# EAGLE design BusBoard (EAGLE 9.6.2)
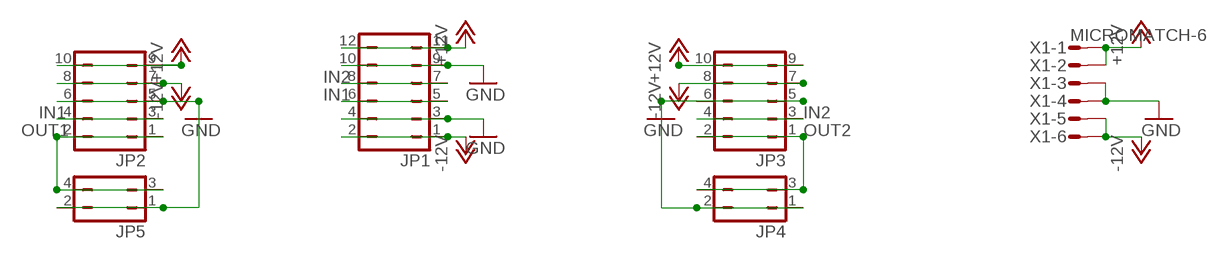
[diagram p0: schematic, sheet 1]

## Parts
JP1  JP6Q  [JP6Q]
JP2  JP5Q  [JP5Q]
JP3  JP5Q  [JP5Q]
JP4  JP2Q  [JP2Q]
JP5  JP2Q  [JP2Q]
X1  MICROMATCH-6  [MICROMATCH-6]

## Nets
+12V: JP1.11 JP1.12 JP2.9 JP2.10 JP3.9 JP3.10 X1.1 X1.2
-12V: JP1.1 JP1.2 JP2.7 JP2.8 JP3.7 JP3.8 X1.5 X1.6
GND: JP1.3 JP1.4 JP1.9 JP1.10 JP2.5 JP2.6 JP3.5 JP3.6 JP4.1 JP4.2 JP5.1 JP5.2 X1.3 X1.4
IN1: JP1.5 JP1.6 JP2.3 JP2.4
IN2: JP1.7 JP1.8 JP3.3 JP3.4
OUT1: JP2.1 JP2.2 JP5.3 JP5.4
OUT2: JP3.1 JP3.2 JP4.3 JP4.4

## Library data of the parts
JP1 = jumper:JP6Q: JUMPER
JP2 JP3 = jumper:JP5Q: JUMPER
JP4 JP5 = jumper:JP2Q: JUMPER
X1 = con-amp-micromatch:MICROMATCH-6: MicroMaTch 6 7-215464-6 / 0-215464-6 Drawing Number C-215464 DDEController.pdf; MPN: 7-215464-6; OC_FARNELL: 3784630; OC_NEWARK: 19R8125

## Board
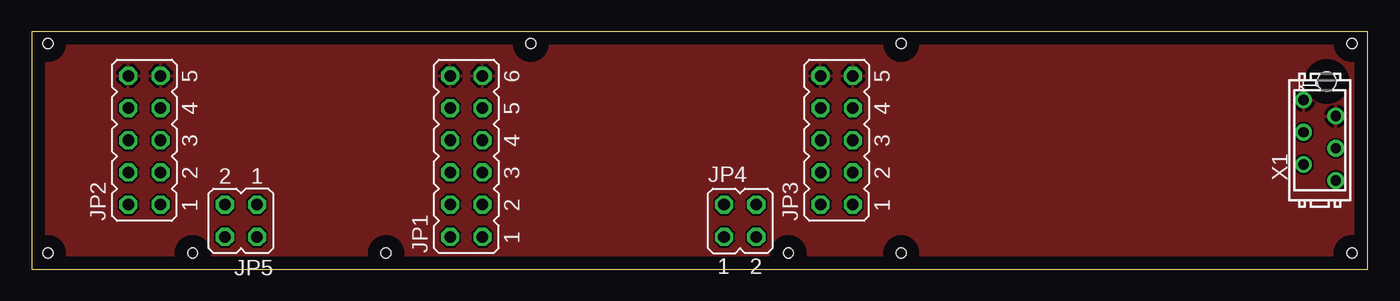
[diagram p1: board, top side]
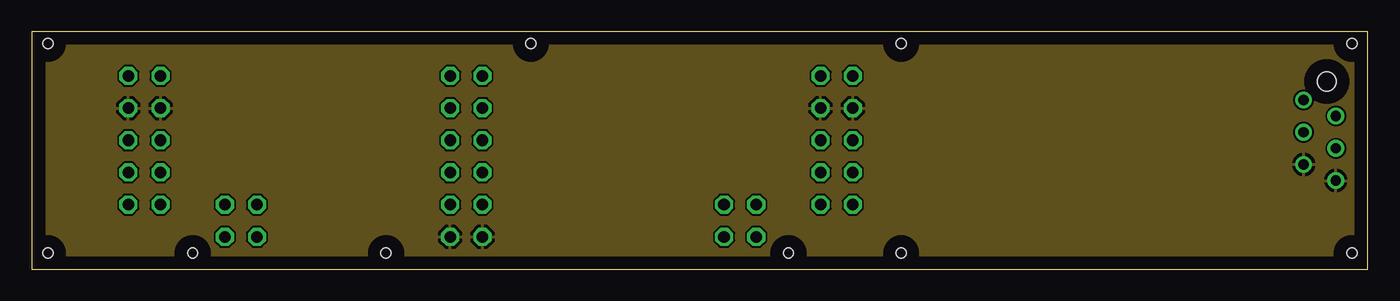
[diagram p2: board, inner layer Route2]
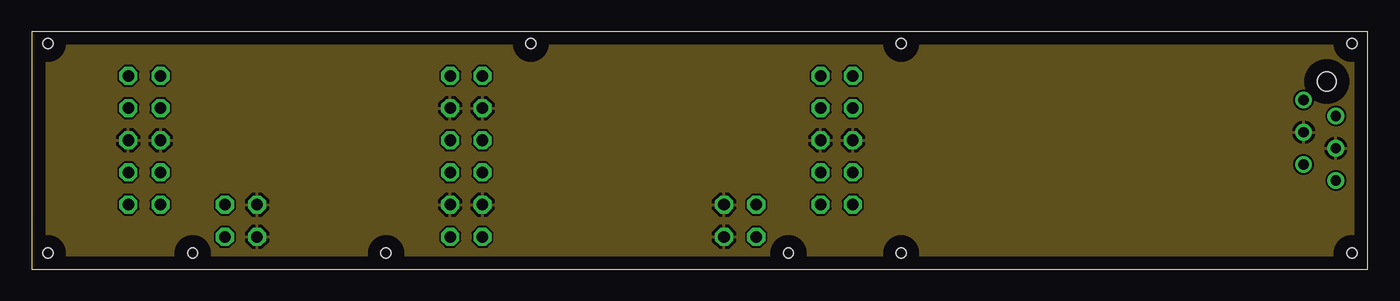
[diagram p3: board, inner layer Route15]
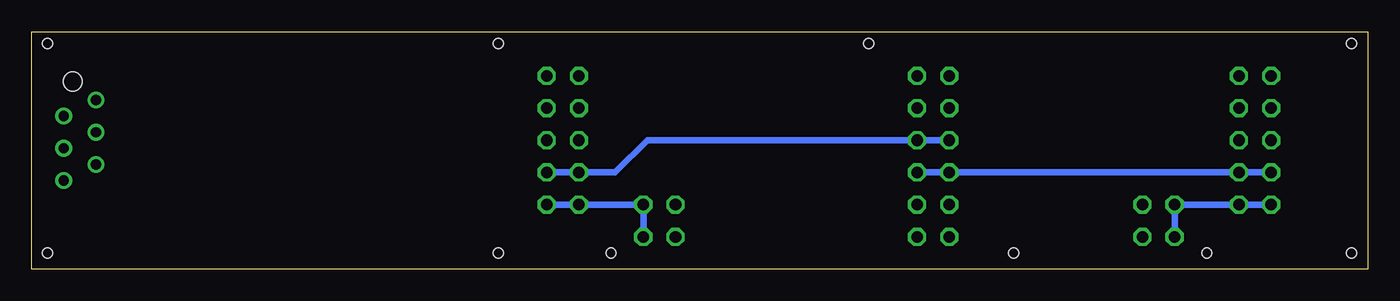
[diagram p4: board, bottom side, seen from below]

Size 105.39 x 18.72 mm. Coordinates in mm from the lower left corner, seen from the top.
Outline: 0,0 105.39,0 105.39,18.72 0,18.72 0,0
Copper layers (1+2+15+16): Top 0.035mm / dielectric 1.1mm / Route2 0.035mm / dielectric 0.15mm / Route15 0.035mm / dielectric 0.2mm / Bottom 0.035mm
Design rules "default *": minimum track width 6mil, minimum drill 0.35mm, track to track 6mil, track to pad 6mil, pad to pad 6mil, via to via 6mil, smd to smd 6mil, copper to edge 40mil, drill to drill 6mil, minimum pad ring 10mil, minimum via ring 8mil, stop-mask expansion 4mil, vias tented up to drill 0mil, thermal gap 10mil
Holes 0.8 mm at 1.27,17.78 1.27,1.27 104.14,1.27 104.14,17.78 27.94,1.27 39.37,17.78 12.7,1.27 59.69,1.27 68.58,17.78 68.58,1.27

### Footprints (pad centres in the part's own frame; a part is rotated, then mirrored left to right if it is on the bottom)
JP6Q = drill 0.914 octagon: 1 -6.35,-1.27; 2 -6.35,1.27; 3 -3.81,-1.27; 4 -3.81,1.27; 5 -1.27,-1.27; 6 -1.27,1.27; 7 1.27,-1.27; 8 1.27,1.27; 9 3.81,-1.27; 10 3.81,1.27; 11 6.35,-1.27; 12 6.35,1.27
JP5Q = drill 0.914 octagon: 1 -5.08,-1.27; 2 -5.08,1.27; 3 -2.54,-1.27; 4 -2.54,1.27; 5 0,-1.27; 6 0,1.27; 7 2.54,-1.27; 8 2.54,1.27; 9 5.08,-1.27; 10 5.08,1.27
JP2Q = drill 0.914 octagon: 1 -1.27,-1.27; 2 -1.27,1.27; 3 1.27,-1.27; 4 1.27,1.27
MICROMATCH-6 = drill 0.813: 1 3.175,1.27; 2 1.905,-1.27; 3 0.635,1.27; 4 -0.635,-1.27; 5 -1.905,1.27; 6 -3.175,-1.27 | hole 1.5: 4.63,-0.55

### Placement (x,y rotation side)
JP1  34.29,8.89 90 top
JP2  8.89,10.16 90 top
JP3  63.5,10.16 90 top
JP4  55.88,3.81 0 top
JP5  16.51,3.81 180 top
X1  101.6,10.16 90 top

### Tracks (layer width: path | path; a pad name or v marks a point on that pad's centre or on a via)
+12V
  pour Top: 0.95,18.41 0.32,17.78 0.32,0.95 0.95,0.32 104.46,0.32 105.09,0.95 105.09,17.78 104.46,18.41
-12V
  pour Route2: 0.95,18.41 0.64,18.1 0.64,0.64 0.95,0.32 104.46,0.32 105.09,0.95 105.09,17.78 104.46,18.41
GND
  pour Route15: 0.95,18.41 0.95,0.32 104.46,0.32 105.09,0.95 105.09,17.78 104.46,18.41
IN1
  Bottom 0.508: JP2.4 JP2.3 JP1.6 33.34,7.62 JP1.5
IN2
  Bottom 0.508: JP1.8 JP1.7 56.83,10.16 59.37,7.62 JP3.4 JP3.3
OUT1
  Bottom 0.508: JP2.2 JP2.1 JP5.3 JP5.4
OUT2
  Bottom 0.508: JP4.3 JP4.4 JP3.2 JP3.1